# Altium schematic sheet MCU, Radios, and Sensors.SchDoc: MCU, Radios, and Sensors
size A4; SheetNumber: 1; SheetTotal: 4
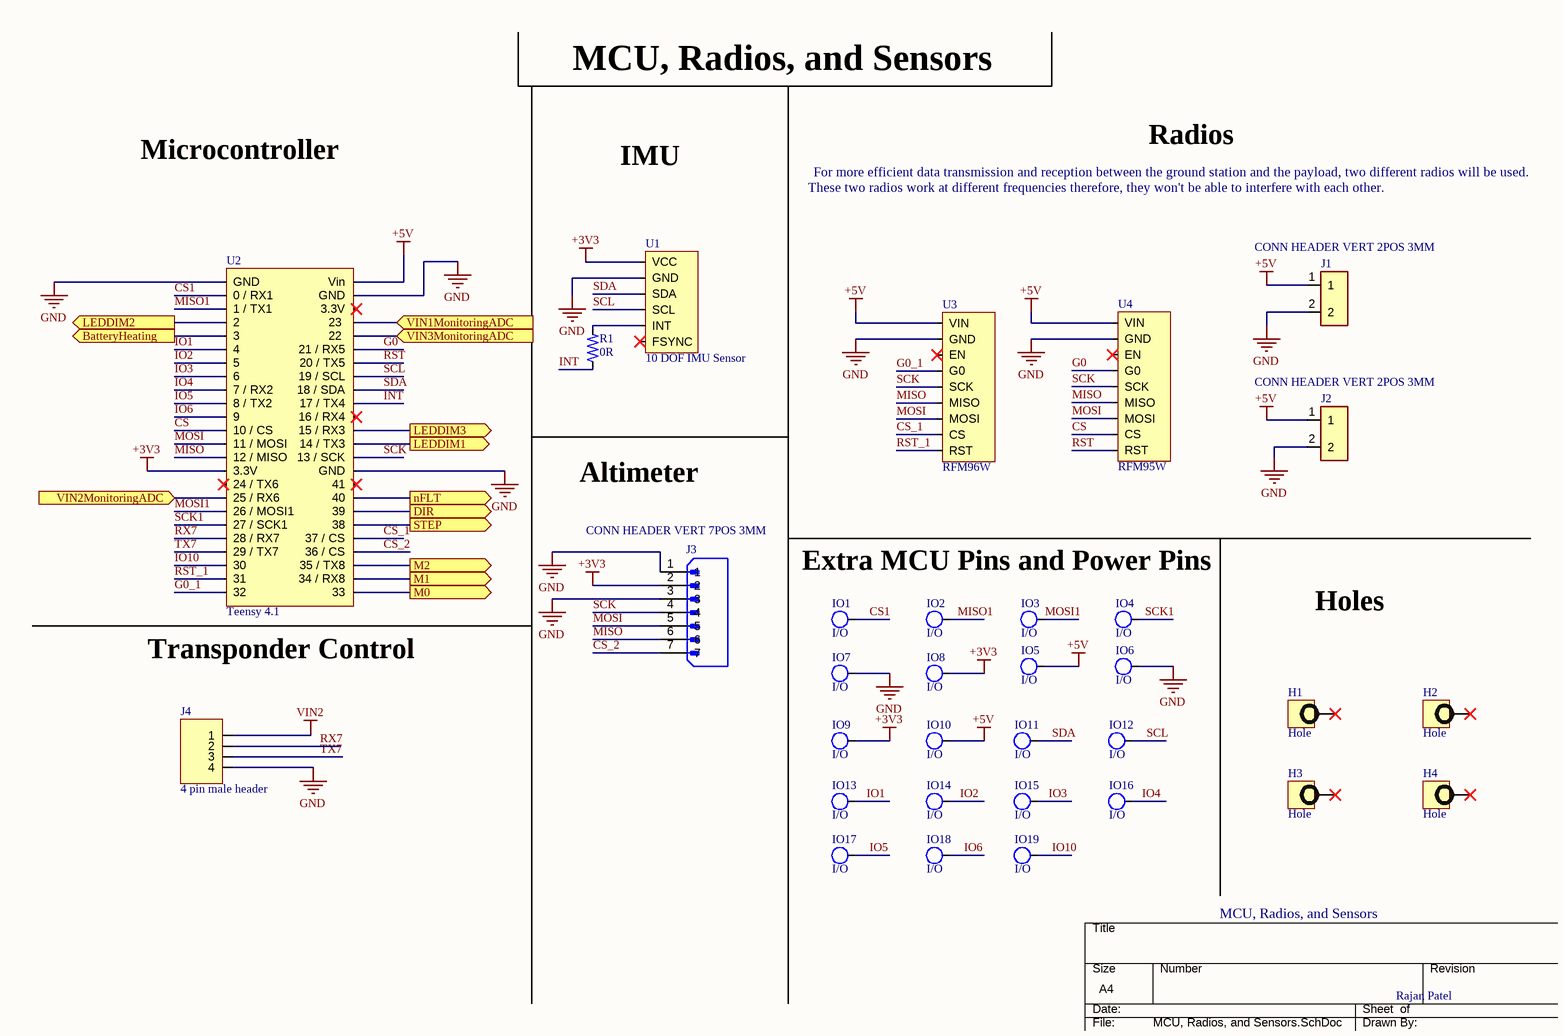
[diagram p0: MCU, Radios, and Sensors.SchDoc]

## Parts
H1  Hole  [M3 Holes]
H2  Hole  [M3 Holes]
H3  Hole  [M3 Holes]
H4  Hole  [M3 Holes]
IO1  I/O  [Pins]
IO2  I/O  [Pins]
IO3  I/O  [Pins]
IO4  I/O  [Pins]
IO5  I/O  [Pins]
IO6  I/O  [Pins]
IO7  I/O  [Pins]
IO8  I/O  [Pins]
IO9  I/O  [Pins]
IO10  I/O  [Pins]
IO11  I/O  [Pins]
IO12  I/O  [Pins]
IO13  I/O  [Pins]
IO14  I/O  [Pins]
IO15  I/O  [Pins]
IO16  I/O  [Pins]
IO17  I/O  [Pins]
IO18  I/O  [Pins]
IO19  I/O  [Pins]
J1  CONN HEADER VERT 2POS 3MM  [CONN HEADER VERT 2POS 3MM]
J2  CONN HEADER VERT 2POS 3MM  [CONN HEADER VERT 2POS 3MM]
J3  CONN HEADER VERT 7POS 3MM  [MOLEX_436500728]
J4  4 pin male header  [4 Pin Male Header]
R1  0R  [res 0805]
U1  10 DOF IMU Sensor  [10 DOF IMU Sensor]
U2  Teensy 4.1  [Teensy 4.1]
U3  RFM96W  [RFM95W]
U4  RFM95W  [RFM95W]

## Ports
BatteryHeating (out, see Battery Heating System[2B]), DIR (out, see LEDs, and Motors[3B]), LEDDIM1 (out, see LEDs, and Motors[1B]), LEDDIM2 (out, see LEDs, and Motors[2B]), LEDDIM3 (out, see LEDs, and Motors[1C]), M0 (out, see LEDs, and Motors[3B]), M1 (out, see LEDs, and Motors[3B]), M2 (out, see LEDs, and Motors[3B]), nFLT (out, see LEDs, and Motors[3B]), STEP (out, see LEDs, and Motors[3B]), VIN1MonitoringADC (in, see Power Management[1B]), VIN2MonitoringADC (in, see Power Management[3B]), VIN3MonitoringADC (in, see Power Management[4C])

## Nets
+3V3: IO8.1 IO9.1 J3.2 U1.1(VCC) U2.15(3.3V)
+5V: IO5.1 IO10.1 J1.1 J2.1 U2.48(Vin) U3.1(VIN) U4.1(VIN)
GND: IO6.1 IO7.1 J1.2 J2.2 J3.1 J3.3 J4.4 U1.2(GND) U2.1(GND) U2.34(GND) U2.47(GND) U3.2(GND) U4.2(GND)
VIN2: J4.1
BatteryHeating: U2.5(3) ; port BatteryHeating
CS: U2.12(10_/_CS) U4.8(CS)
CS1: IO1.1 U2.2(0_/_RX1)
CS_1: U2.29(37_/_CS) U3.8(CS)
CS_2: J3.7 U2.28(36_/_CS)
DIR: U2.31(39) ; port DIR
G0: U2.43(21_/_RX5) U4.4(G0)
G0_1: U2.24(32) U3.4(G0)
INT: R1.1 U2.39(17_/_TX4)
IO1: IO13.1 U2.6(4)
IO2: IO14.1 U2.7(5)
IO3: IO15.1 U2.8(6)
IO4: IO16.1 U2.9(7_/_RX2)
IO5: IO17.1 U2.10(8_/_TX2)
IO6: IO18.1 U2.11(9)
IO10: IO19.1 U2.22(30)
LEDDIM1: U2.36(14_/_TX3) ; port LEDDIM1
LEDDIM2: U2.4(2) ; port LEDDIM2
LEDDIM3: U2.37(15_/_RX3) ; port LEDDIM3
M0: U2.25(33) ; port M0
M1: U2.26(34_/_RX8) ; port M1
M2: U2.27(35_/_TX8) ; port M2
MISO: J3.6 U2.14(12_/_MISO) U3.6(MISO) U4.6(MISO)
MISO1: IO2.1 U2.3(1_/_TX1)
MOSI: J3.5 U2.13(11_/_MOSI) U3.7(MOSI) U4.7(MOSI)
MOSI1: IO3.1 U2.18(26_/_MOSI1)
nFLT: U2.32(40) ; port nFLT
RST: U2.42(20_/_TX5) U4.9(RST)
RST_1: U2.23(31) U3.9(RST)
RX7: J4.2 U2.20(28_/_RX7)
SCK: J3.4 U2.35(13_/_SCK) U3.5(SCK) U4.5(SCK)
SCK1: IO4.1 U2.19(27_/_SCK1)
SCL: IO12.1 U1.4(SCL) U2.41(19_/_SCL)
SDA: IO11.1 U1.3(SDA) U2.40(18_/_SDA)
STEP: U2.30(38) ; port STEP
TX7: J4.3 U2.21(29_/_TX7)
VIN1MonitoringADC: U2.45(23) ; port VIN1MonitoringADC
VIN2MonitoringADC: U2.17(25_/_RX6) ; port VIN2MonitoringADC
VIN3MonitoringADC: U2.44(22) ; port VIN3MonitoringADC
NetR1_2: R1.2 U1.5(INT)

Not connected (* = marked no-connect by the designer): H1 1(TERMINAL)*; H2 1(TERMINAL)*; H3 1(TERMINAL)*; H4 1(TERMINAL)*; U1 6(FSYNC)*; U2 16(24_/_TX6)* 33(41)* 38(16_/_RX4)* 46(3.3V)*; U3 3(EN)*; U4 3(EN)*

## Notes on the sheet
- MCU, Radios, and Sensors
- Microcontroller
- IMU
- For more efficient data transmission and reception between the ground station and the payload, two different radios will be used.
- Radios
- These two radios work at different frequencies therefore, they won't be able to interfere with each other.
- Altimeter
- Extra MCU Pins and Power Pins
- Holes
- (near U2) Transponder Control
- Rajan Patel

## Library data of the parts
J1 J2 = 0436500228: Rectangular Power Connector, 2 Contact(s), Female, Solder Terminal; Manufacturer Part Number: 43650-0228; Manufacturer Series: 43650; MF: Molex; MP: 0436500200; Connector Type: Power,Rectangular; Number of Contacts: 2; Option: General Purpose; Contact Style: SQ PIN-SKT; Durability: 30Cycles; Empty Shell: No; Mating Information: MULTIPLE MATING PARTS AVAILABLE; Number Of Connectors: 1; Rated Current (Signal): 5A; Board Mounting Option: PEG; Body/Shell Style: RECEPTACLE; Contact Resistance: 10mR; Dielectric Withstanding Voltage (AC): 1.5kV; Insertion Force-Max: 8.0064N; Insulation Resistance: 1GR; Polarization Key: POLARIZED HOUSING; Withdrawl Force-Min: 3.614N; Mating Contact Pitch: 0.118inch; Mounting Option 1: POLARIZED LCK; Mounting Option 2: LOCKING; Plating Thickness: 15uin; Body Breadth: 0.219inch; Body Depth: 0.39inch; Body Length: 0.38inch; Reference Standard: UL; Reliability: COMMERCIAL; SnapEDA_Link: https://www.snapeda.com/parts/0436500200/Molex/view-part/552556/?ref=snap; Price: None; Availability: Unavailable; Package: None; Value: *; Supplier: Mouser; Supplier Part Number: 538-43650-0228; Manufacturer: Molex; RoHS: Yes; Category: Headers and Wire Housings; Stock: 12783; Pricing: 1=0.78, 10=0.537, 50=0.537, 100=0.537, 1000=0.536, 10000=0.473 (USD); Mounting Technology: Board; Contact Finish - Mating: AU; Insulation Color: Black; Insulation Material: Polymer; Shell Material: Polymer; Contact Material: Brass; Contact Finish - Termination: TIN/LEAD OVER NICKEL; Min Operating Temperature: -40°C; Max Operating Temperature: 105°C; Contact Gender: Male; Termination: Solder; Contact Pattern: RECTANGULAR; Filter Feature: No; Mixed Contacts: No; Mounting Style: STRAIGHT; Number of Rows Loaded: 1; Number Of PCB Rows: 1; PCB Contact Pattern: RECTANGULAR; Terminal Length: 0.125inch; Terminal Pitch: 2.9972mm; Flammability Rating: UL94 V-0; Reach SVHC Compliant: Yes; RoHS Compliant: Yes; DIN Conformance: No; IEC Conformance: No; MIL Conformance: No; ComponentLink1URL: https://datasheet.ciiva.com:443/pdfs/VipMasterIC/IC/MOLE/MOLES07498/MOLES07498-1.pdf?src-supplier=IHS+Markit; ComponentLink1Description: https://datasheet.ciiva.com:443/pdfs/VipMasterIC/IC/MOLE/MOLES07498/MOLES07498-1.pdf?src-supplier=IHS+Markit; ComponentLink2URL: https://datasheet.ciiva.com/13550/0436500228-pcb-headers-148884-13550297.pdf?src-supplier=Mouser; ComponentLink2Description: https://datasheet.ciiva.com/13550/0436500228-pcb-headers-148884-13550297.pdf?src-supplier=Mouser
J3 = 436500728: Connector Header Through Hole 7 position 0.118 (3.00mm); MF: Molex; SnapEDA_Link: https://www.snapeda.com/parts/436500728/Molex/view-part/?ref=snap; Package: None; Value: *; MP: 436500728; Digi-Key_Part_Number: WM10682-ND; Check_prices: https://www.snapeda.com/parts/436500728/Molex/view-part/?ref=eda
R1 = Resistor 0805: MP: 2-2176053-2; Resistance: .39; Power_Rating: .25 W; MF: TE Connectivity; Tolerance: 1%; Package: 0805; Value: *; SnapEDA_Link: https://www.snapeda.com/parts/2-2176053-2/TE%20Connectivity/view-part/2214511/?ref=snap; Availability: Unavailable; Price: None; EU_RoHS_Compliance: Compliant with Exemptions
U1 = 10 DOF IMU Sensor: 10 DOF IMU Sensor, ICM20948 Onboard, Low Power, High Precision
U2 = Teensy 4.1: iMXRT1062 Microcontroller Development Board 600MHz CPU 1GB RAM 8MB Flash; Manufacturer: SparkFun; Manufacturer Part Number: DEV-16771; Supplier: Digikey; Supplier Part Number: 1568-DEV-16771-ND; RoHS: No; Category: Embedded Processors and Controllers; Stock: 2404; Pricing: 1=37.2 (USD); ComponentLink1URL: https://media.digikey.com/pdf/Data%20Sheets/Sparkfun%20PDFs/DEV-16771_Web.pdf?src-supplier=Digikey; ComponentLink1Description: https://media.digikey.com/pdf/Data%20Sheets/Sparkfun%20PDFs/DEV-16771_Web.pdf?src-supplier=Digikey
U3 = RFM96W: Banana Plug; Female to Multi-Stacking Banana Plug; Nickel Plated Brass; Manufacturer: Adafruit Industries; Manufacturer Part Number: 3072; Supplier: Digikey; Supplier Part Number: 1528-1667-ND; RoHS: No; Category: RF Semiconductors and Devices; Stock: 109; Pricing: 1=19.95 (USD); ComponentLink1URL: https://learn.adafruit.com/downloads/pdf/adafruit-rfm69hcw-and-rfm96-rfm95-rfm98-lora-packet-padio-breakouts.pdf?src-supplier=Digikey; ComponentLink1Description: https://learn.adafruit.com/downloads/pdf/adafruit-rfm69hcw-and-rfm96-rfm95-rfm98-lora-packet-padio-breakouts.pdf?src-supplier=Digikey
U4 = RFM95W: Adafruit RFM95W LoRa Radio Transceiver Breakout - 868 or 915 MHz; Manufacturer: Adafruit Industries; Manufacturer Part Number: 3072; Supplier: Digikey; Supplier Part Number: 1528-1667-ND; RoHS: No; Category: RF Semiconductors and Devices; Stock: 109; Pricing: 1=19.95 (USD); ComponentLink1URL: https://learn.adafruit.com/downloads/pdf/adafruit-rfm69hcw-and-rfm96-rfm95-rfm98-lora-packet-padio-breakouts.pdf?src-supplier=Digikey; ComponentLink1Description: https://learn.adafruit.com/downloads/pdf/adafruit-rfm69hcw-and-rfm96-rfm95-rfm98-lora-packet-padio-breakouts.pdf?src-supplier=Digikey